# EAGLE design Temperature-Humidity (EAGLE 6.5.0)
DESIGNER: theairboard.cc; REV: 1.0
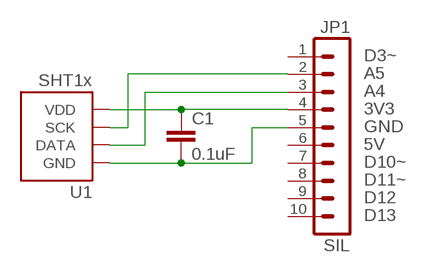
[diagram p0: schematic, sheet 1]

## Parts
C1  0.1uF  CAP0603-CAP  [0603-CAP]
JP1  SIL  1X10-SIL-CONNECTOR  [SIL-1X10]
U1  SHT1x  SHT1XSMD  [SHT1X]

## Nets
GND: C1.2 JP1.5 U1.1(GND)
N$4: JP1.2 U1.3(SCK)
N$5: JP1.3 U1.2(DATA)
VDD: C1.1 JP1.4 U1.4(VDD)
Unconnected: JP1.1 JP1.6 JP1.7 JP1.8 JP1.9 JP1.10

## Notes on the sheet
- D3~
- A5
- A4
- 3V3
- GND
- 5V
- D10~
- D11~
- D12
- D13

## Library data of the parts
C1 = SparkFun:CAP: Capacitor Standard 0603 ceramic capacitor, and 0.1" leaded capacitor.
JP1 = theairboard:1X10-SIL-CONNECTOR: BOARD-BOARD CONNECTOR HEADER, 1ROW www.farnell.com/datasheets/8281.pdf; MANUFACTURER: FCI; OC_FARNELL: 1097958; OC_NEWARK: 93K5133; PART_NUMBER: 77315-818-36LF
U1 = SparkFun-Sensors:SHT1X: SHT1x Humdity Sensor Sensirion humdity sensor. Schematic element and footprint proven. Spark Fun Electronics SKU : COM-08227

## Board
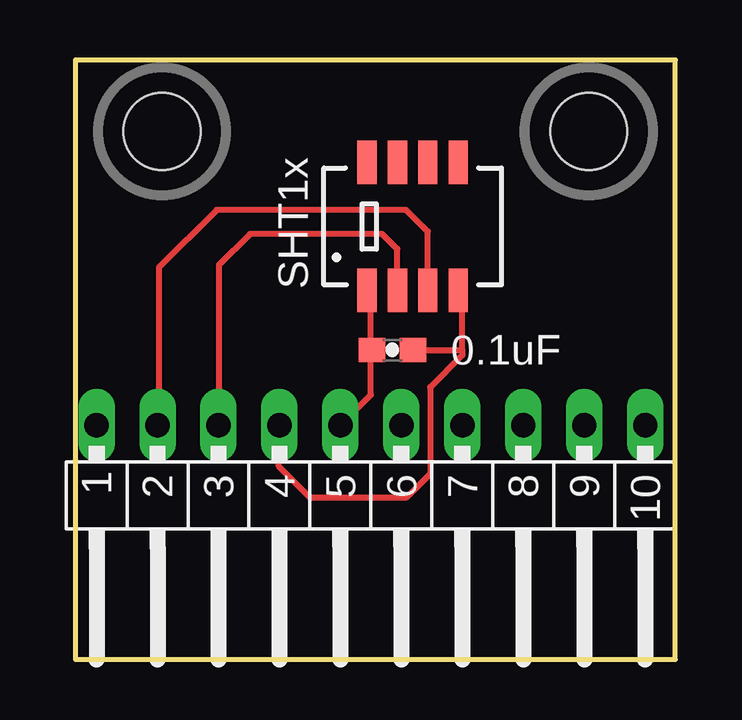
[diagram p1: board, top side]
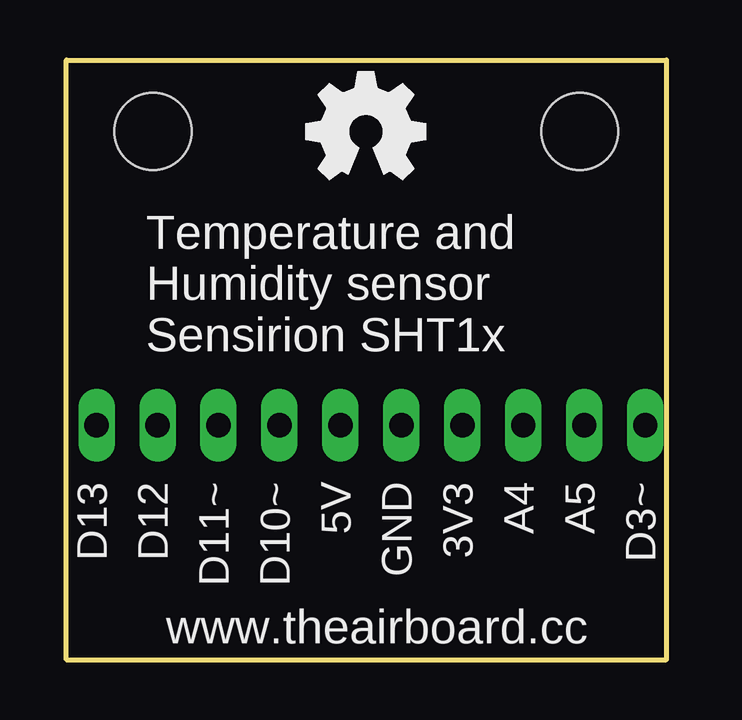
[diagram p2: board, bottom side, seen from below]

Size 25 x 25 mm. Coordinates in mm from the lower left corner, seen from the top.
Copper layers (1*16): Top 0.035mm / dielectric 1.5mm / Bottom 0.035mm
Design rules "default": minimum track width 10mil, minimum drill 24mil, track to track 8mil, track to pad 8mil, pad to pad 8mil, via to via 8mil, smd to smd 8mil, copper to edge 40mil, drill to drill 8mil, minimum pad ring 10mil, minimum via ring 8mil, stop-mask expansion 4mil, vias tented up to drill 0mil, thermal gap 10mil

### Footprints (pad centres in the part's own frame; a part is rotated, then mirrored left to right if it is on the bottom)
0603-CAP = smd 1.1 x 1: 1 -0.85,0; 2 0.85,0
SIL-1X10 = drill 1.016 long: 1 11.43,0; 2 8.89,0; 3 6.35,0; 4 3.81,0; 5 1.27,0; 6 -1.27,0; 7 -3.81,0; 8 -6.35,0; 9 -8.89,0; 10 -11.43,0
SHT1X = smd 1.8 x 0.8: 1 -2.667,1.905; 2 -2.667,0.635; 3 -2.667,-0.635; 4 -2.667,-1.905; 5 2.667,-1.905; 6 2.667,-0.635; 7 2.667,0.635; 8 2.667,1.905
LAYOUT25X25 = hole 3.2: 21.61,22.275; 3.83,22.275

### Placement (x,y rotation side)
C1  13.21,12.91 180 top
FRAME1  SCH_FRAME  [BOARD_FRAME]  -104.22,-73.25 0 top  (outside the outline)
JP1  12.31,9.77 180 top
U1  14.05,18.06 90 top
U$2  [LAYOUT25X25]  -0.22,-0.25 0 top

### Tracks (layer width: path | path; a pad name or v marks a point on that pad's centre or on a via)
GND
  Top 0.254: 12.31,12.91 12.31,11.04 JP1.5 | U1.1 12.31,14.85 12.31,12.91 | C1.2 12.31,12.91
N$4
  Top 0.254: U1.3 14.68,17.84 13.78,18.75 5.88,18.75 3.48,16.35 3.48,9.83 JP1.2
N$5
  Top 0.254: U1.2 13.41,17.11 12.78,17.75 7.28,17.75 5.98,16.45 5.98,9.79 JP1.3
VDD
  Top 0.254: 16.12,12.91 16.12,14.85 U1.4 | C1.1 16.12,12.91 | 16.12,12.91 16.12,12.69 14.78,11.35 14.78,7.75 13.78,6.75 9.78,6.75 8.48,8.05 8.48,9.75 JP1.4

### Text on the board
bNames: Temperature and / Humidity sensor / Sensirion SHT1x